# Altium schematic sheet MOTOR_DVR.SchDoc
size A3; DocumentNumber: 3; SheetNumber: 5; SheetTotal: 8
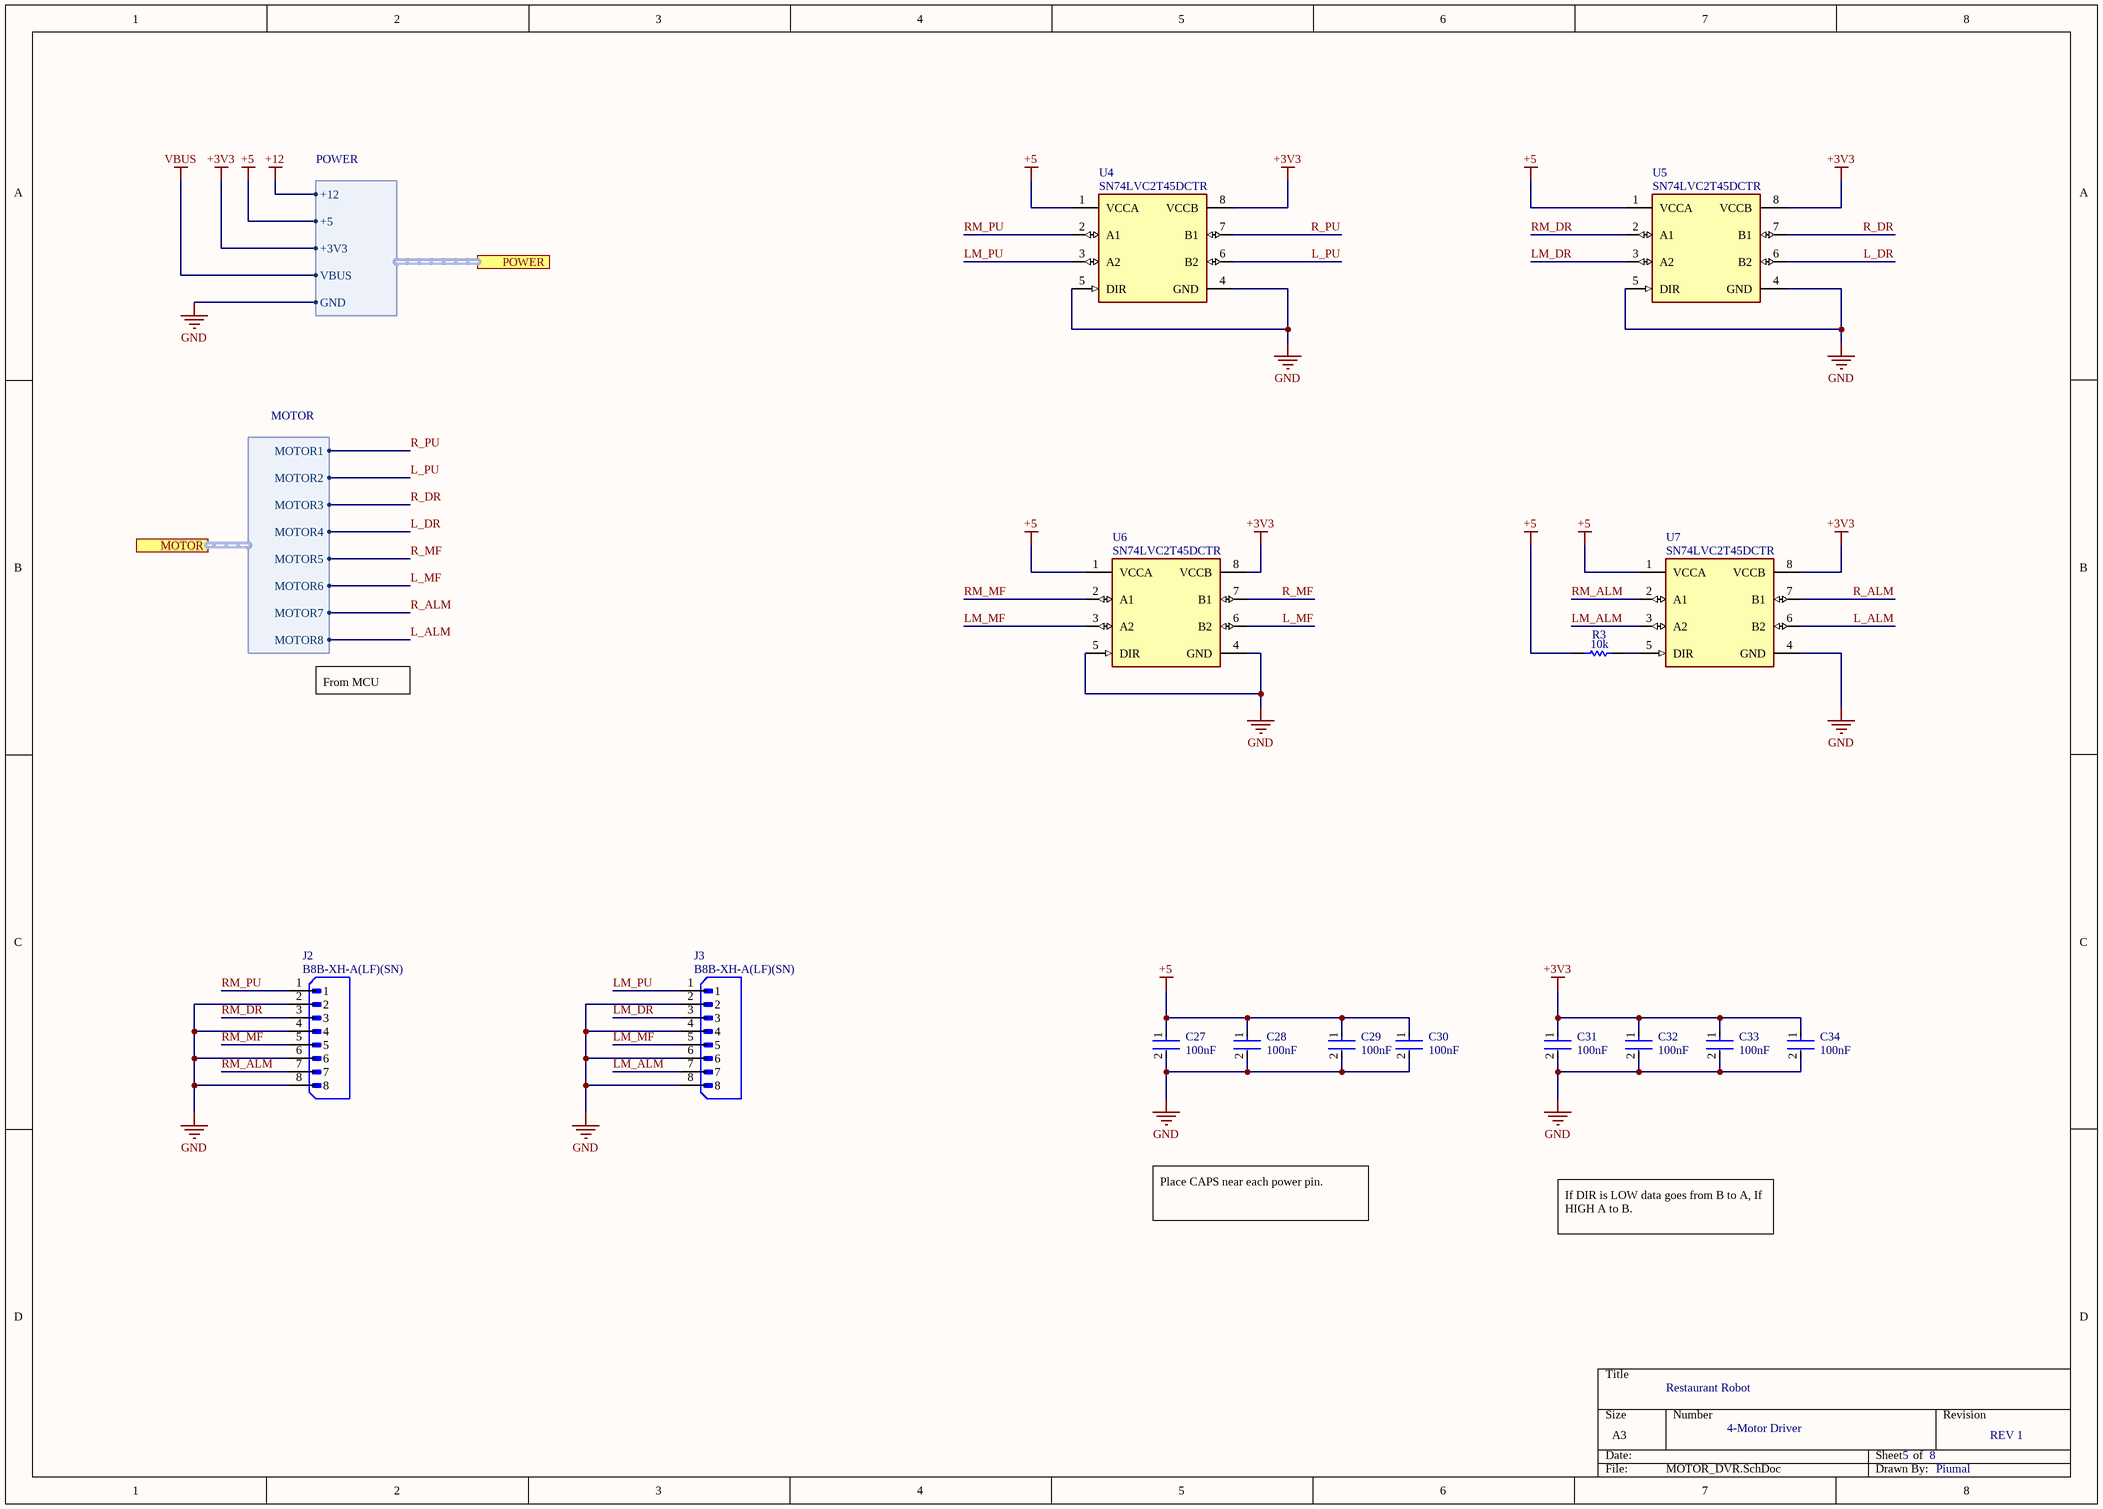
[diagram p0: MOTOR_DVR.SchDoc]

## Parts
C27  Capacitance: 100nF  [FP-CL21-IPC_A]  (hidden comment: CL21B104KOANNNC)
C28  Capacitance: 100nF  [FP-CL21-IPC_A]  (hidden comment: CL21B104KOANNNC)
C29  Capacitance: 100nF  [FP-CL21-IPC_A]  (hidden comment: CL21B104KOANNNC)
C30  Capacitance: 100nF  [FP-CL21-IPC_A]  (hidden comment: CL21B104KOANNNC)
C31  Capacitance: 100nF  [FP-CL21-IPC_A]  (hidden comment: CL21B104KOANNNC)
C32  Capacitance: 100nF  [FP-CL21-IPC_A]  (hidden comment: CL21B104KOANNNC)
C33  Capacitance: 100nF  [FP-CL21-IPC_A]  (hidden comment: CL21B104KOANNNC)
C34  Capacitance: 100nF  [FP-CL21-IPC_A]  (hidden comment: CL21B104KOANNNC)
J2  B8B-XH-A(LF)(SN)  [JST_B8B-XH-A(LF)(SN)]
J3  B8B-XH-A(LF)(SN)  [JST_B8B-XH-A(LF)(SN)]
R3  Resistance: 10k  [RESC2013X60X35ML10T20]  (hidden comment: RC0805JR-0710KL)
U4  SN74LVC2T45DCTR  [FP-DCT0008A-MFG]
U5  SN74LVC2T45DCTR  [FP-DCT0008A-MFG]
U6  SN74LVC2T45DCTR  [FP-DCT0008A-MFG]
U7  SN74LVC2T45DCTR  [FP-DCT0008A-MFG]

## Ports
MOTOR (harness MOTOR), POWER (harness POWER)

## Harnesses
MOTOR: MOTOR1, MOTOR2, MOTOR3, MOTOR4, MOTOR5, MOTOR6, MOTOR7, MOTOR8
POWER: +3V3, GND, +5, VBUS, +12

## Nets
+3V3: C31.1 C32.1 C33.1 C34.1 U4.8(VCCB) U5.8(VCCB) U6.8(VCCB) U7.8(VCCB) ; port POWER.+3V3
+5: C27.1 C28.1 C29.1 C30.1 R3.1 U4.1(VCCA) U5.1(VCCA) U6.1(VCCA) U7.1(VCCA) ; port POWER.+5
+12: port POWER.+12
GND: C27.2 C28.2 C29.2 C30.2 C31.2 C32.2 C33.2 C34.2 J2.2 J2.4 J2.6 J2.8 J3.2 J3.4 J3.6 J3.8 U4.4(GND) U4.5(DIR) U5.4(GND) U5.5(DIR) U6.4(GND) U6.5(DIR) U7.4(GND) ; port POWER.GND
VBUS: port POWER.VBUS
L_ALM: U7.6(B2) ; port MOTOR.MOTOR8
L_DR: U5.6(B2) ; port MOTOR.MOTOR4
L_MF: U6.6(B2) ; port MOTOR.MOTOR6
L_PU: U4.6(B2) ; port MOTOR.MOTOR2
LM_ALM: J3.7 U7.3(A2)
LM_DR: J3.3 U5.3(A2)
LM_MF: J3.5 U6.3(A2)
LM_PU: J3.1 U4.3(A2)
R_ALM: U7.7(B1) ; port MOTOR.MOTOR7
R_DR: U5.7(B1) ; port MOTOR.MOTOR3
R_MF: U6.7(B1) ; port MOTOR.MOTOR5
R_PU: U4.7(B1) ; port MOTOR.MOTOR1
RM_ALM: J2.7 U7.2(A1)
RM_DR: J2.3 U5.2(A1)
RM_MF: J2.5 U6.2(A1)
RM_PU: J2.1 U4.2(A1)
NetR3_2: R3.2 U7.5(DIR)

## Notes on the sheet
- From MCU
- Place CAPS near each power pin.
- If DIR is LOW data goes from B to A, If HIGH A to B.
- Restaurant Robot
- 4-Motor Driver
- 5
- 8
- REV 1
- Piumal

## Library data of the parts
C27-C34 = CMP-13271-003679-1: CL21 Series 0805 100nF 16V ±10% Tolerance X7R Multilayer Ceramic Chip Capacitor; Lead Free: Lead Free; Width: 0.049inch; Voltage Rating (DC): 16V; Tolerance: 10%; Min Operating Temperature: -55°C; Dielectric: X7R; Case Code (Metric): 2012; Packaging: Tape and Reel; Radiation Hardening: No; Length: 2mm; Height: 0.65mm; Voltage Rating: 16V; Mount: Surface Mount; Max Operating Temperature: 125°C; Depth: 1.25mm; Thickness: 0.03inch; Case Code (Imperial): 0805; Case/Package: 0805; Package Quantity: 1
J2 J3 = B8B-XH-A(LF)(SN): Connector Header Through Hole 8 position 0.098 (2.50mm); MF: JST Sales America Inc.; SnapEDA_Link: https://www.snapeda.com/parts/B8B-XH-A(LF)(SN)/JST+Sales+America+Inc./view-part/?ref=snap; Package: None; Value: *; MP: B8B-XH-A(LF)(SN); Check_prices: https://www.snapeda.com/parts/B8B-XH-A(LF)(SN)/JST+Sales+America+Inc./view-part/?ref=eda
R3 = CMP-2000-05025-1: Chip Resistor, 10 KOhm, +/- 5%, 0.125 W, -55 to 155 degC, 0805 (2012 Metric), RoHS, Tape and Reel; Manufacturer: Yageo; Resistor Element Type: ThickFilm; Voltage Rating: 150V; Product Range: RCSeries; SVHC: ToBeAdvised; Resistor Case Style: 0805[2012Metric]; Temperature Coefficient: ±100ppm/degC; Power Rating: 250mW; Automotive Qualification Standard: -; Datasheet Version: REV. 2, 09/2004; Packaging: CutTape; Resistance Tolerance: ±5%; MSL: MSL1-Unlimited; Manufacturer URL: http://www.yageo.com/; Datasheet URL: http://www.yageo.ru/pdf/RC0805.pdf; Package Description: 2-Pin Surface Mounted Device, Body 2 x 1.25 mm; Package Reference: 805
U4-U7 = CMP-0859-00006-5: IC TRNSLTR BIDIRECTIONAL SM8; Manufacturer: Texas Instruments; Logic Function Desc: Non-Inverting; Number Of Outputs: 1; Max Supply Voltage: 5.5V; V B Min: 1.65V; Nominal Supply Current: 2-50uA; Standoff Height: 0mm; Max Junction Temp: +150°C; Data Rate: 420Mbits/s; Device Class L3: Voltage Level Shifters; Temperature Range High: +85°C; ComponentLink2URL: http://www.ti.com/lit/ds/symlink/sn74lvc2t45.pdf; Temperature Range Low: -40°C; ComponentLink2Description: Datasheet; Temperature: -40°C to +85°C; Ambient Temperature Range Low: -40°C; Device Class L2: Logic ICs; Package: DCT0008A; Number Of Inputs: 1; V A Max: 5.5V; RoHS: TRUE; Min Supply Voltage: 1.65V; Manufacturer Part Number: SN74LVC2T45DCTR; Ambient Temperature Range High: +85°C; Number Of Circuits: 1; Ipc Land Pattern Name: SOP65P400X130-8; V B Max: 5.5V; Height: 1.3mm; V A Min: 1.65V; Digikey Description: IC TRNSLTR BIDIRECTIONAL SM8; Octopart: https://octopart.com/sn74lvc2t45dctr-texas+instruments-517051; Device Class L1: Integrated Circuits (ICs); Automotive: No; Category: IC; Lead Free: Yes; Mouser Description: Translation - Voltage Levels DUAL-BIT DUAL SUPPLY TRANSCEIVER